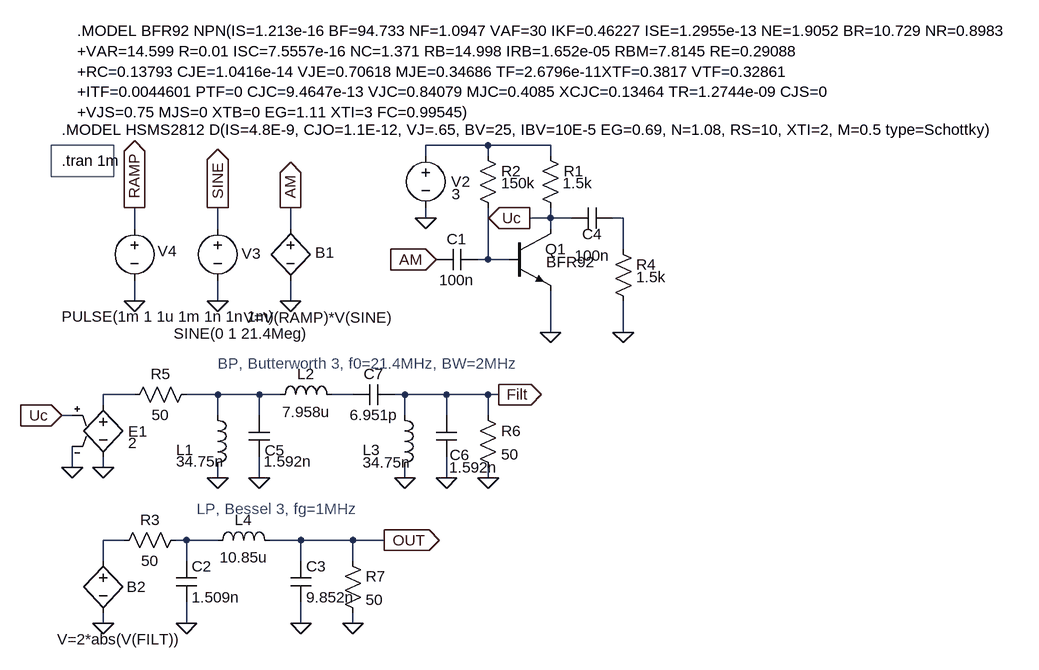
[diagram p0: schematic Rf_Xtoni.asc]
Rf_Xtoni.asc, the LTspice schematic file:
Version 4
SHEET 1 4272 904
WIRE 656 224 656 240
WIRE 656 144 656 128
WIRE 656 128 560 128
WIRE 464 128 464 144
WIRE 656 352 656 416
WIRE 544 304 560 304
WIRE 560 224 560 304
WIRE 560 304 592 304
WIRE 560 144 560 128
WIRE 464 224 464 240
WIRE 656 240 624 240
WIRE 656 240 656 256
WIRE 768 288 768 240
WIRE 768 240 752 240
WIRE 768 368 768 416
WIRE -32 528 -32 512
WIRE -32 512 16 512
WIRE -80 592 -80 624
WIRE -80 544 -96 544
WIRE -32 608 -32 624
WIRE 144 512 96 512
WIRE 144 512 144 544
WIRE 144 512 208 512
WIRE 208 512 208 544
WIRE 208 512 240 512
WIRE 208 608 208 640
WIRE 144 624 144 640
WIRE 320 512 352 512
WIRE 432 512 432 544
WIRE 432 624 432 640
WIRE 432 512 496 512
WIRE 496 512 496 544
WIRE 496 608 496 640
WIRE 496 512 560 512
WIRE 560 512 560 544
WIRE 560 624 560 640
WIRE 416 512 432 512
WIRE 560 512 576 512
WIRE 16 256 16 224
WIRE 144 256 144 224
WIRE 256 256 256 224
WIRE 16 336 16 368
WIRE 144 336 144 368
WIRE 256 336 256 368
WIRE -32 768 -32 736
WIRE -32 736 0 736
WIRE 80 736 96 736
WIRE 96 768 96 736
WIRE 96 736 144 736
WIRE 96 832 96 864
WIRE -32 848 -32 864
WIRE 224 736 272 736
WIRE 272 736 272 768
WIRE 272 832 272 864
WIRE 272 736 352 736
WIRE 352 736 352 768
WIRE 352 848 352 864
WIRE 352 736 400 736
WIRE 560 128 464 128
WIRE 656 240 688 240
FLAG 464 240 0
FLAG 656 416 0
FLAG 624 240 Uc
IOPIN 624 240 Out
FLAG 768 416 0
FLAG 480 304 AM
IOPIN 480 304 In
FLAG -32 624 0
FLAG -80 624 0
FLAG -96 544 Uc
IOPIN -96 544 In
FLAG 144 640 0
FLAG 208 640 0
FLAG 432 640 0
FLAG 496 640 0
FLAG 560 640 0
FLAG 576 512 Filt
IOPIN 576 512 Out
FLAG 16 368 0
FLAG 144 368 0
FLAG 256 368 0
FLAG 16 224 RAMP
IOPIN 16 224 Out
FLAG 256 224 AM
IOPIN 256 224 Out
FLAG 144 224 SINE
IOPIN 144 224 Out
FLAG -32 864 0
FLAG 96 864 0
FLAG 400 736 OUT
IOPIN 400 736 Out
FLAG 272 864 0
FLAG 352 864 0
SYMBOL npn 592 256 R0
WINDOW 3 57 52 Left 0
SYMATTR Value BFR92
SYMATTR InstName Q1
SYMBOL voltage 464 128 R0
WINDOW 0 39 56 Left 0
WINDOW 3 40 75 Left 0
WINDOW 123 0 0 Left 0
WINDOW 39 0 0 Left 0
SYMATTR InstName V2
SYMATTR Value 3
SYMBOL cap 480 320 R270
WINDOW 0 32 32 VTop 0
WINDOW 3 0 32 VBottom 0
SYMATTR InstName C1
SYMATTR Value 100n
SYMBOL res 544 128 R0
WINDOW 3 36 58 Left 0
SYMATTR Value 150k
SYMATTR InstName R2
SYMBOL res 640 128 R0
WINDOW 3 35 58 Left 0
SYMATTR Value 1.5k
SYMATTR InstName R1
SYMBOL cap 752 224 R90
WINDOW 0 56 32 VBottom 0
WINDOW 3 58 32 VTop 0
SYMATTR InstName C4
SYMATTR Value 100n
SYMBOL res 752 272 R0
WINDOW 3 36 59 Left 0
SYMATTR Value 1.5k
SYMATTR InstName R4
SYMBOL e -32 512 R0
WINDOW 0 38 57 Left 0
WINDOW 3 38 74 Left 0
SYMATTR InstName E1
SYMATTR Value 2
SYMBOL res 0 528 R270
WINDOW 0 32 56 VTop 0
WINDOW 3 0 56 VBottom 0
SYMATTR InstName R5
SYMATTR Value 50
SYMBOL ind 128 528 R0
WINDOW 0 -48 69 Left 0
WINDOW 3 -48 87 Left 0
SYMATTR InstName L1
SYMATTR Value 34.75n
SYMBOL cap 192 544 R0
WINDOW 0 24 54 Left 0
WINDOW 3 23 71 Left 0
SYMATTR InstName C5
SYMATTR Value 1.592n
SYMBOL ind 224 528 R270
WINDOW 0 32 56 VTop 0
WINDOW 3 5 56 VBottom 0
SYMATTR InstName L2
SYMATTR Value 7.958u
SYMBOL res 544 528 R0
SYMATTR InstName R6
SYMATTR Value 50
SYMBOL cap 352 528 R270
WINDOW 0 32 32 VTop 0
WINDOW 3 0 32 VBottom 0
SYMATTR InstName C7
SYMATTR Value 6.951p
SYMBOL ind 416 528 R0
WINDOW 0 -49 69 Left 0
WINDOW 3 -49 88 Left 0
SYMATTR InstName L3
SYMATTR Value 34.75n
SYMBOL cap 480 544 R0
WINDOW 0 21 61 Left 0
WINDOW 3 20 80 Left 0
SYMATTR InstName C6
SYMATTR Value 1.592n
SYMBOL voltage 144 240 R0
WINDOW 0 37 55 Left 0
WINDOW 3 -68 178 Left 0
WINDOW 39 0 0 Left 0
SYMATTR InstName V3
SYMATTR Value SINE(0 1 21.4Meg)
SYMATTR Value2 AC 0
SYMBOL voltage 16 240 R0
WINDOW 0 36 51 Left 0
WINDOW 3 -112 152 Left 0
WINDOW 123 0 0 Left 0
WINDOW 39 0 0 Left 0
SYMATTR InstName V4
SYMATTR Value PULSE(1m 1 1u 1m 1n 1n 1m)
SYMBOL bv 256 240 R0
WINDOW 0 38 53 Left 0
WINDOW 3 -72 153 Left 0
SYMATTR InstName B1
SYMATTR Value V=V(RAMP)*V(SINE)
SYMBOL bv -32 752 R0
WINDOW 0 36 56 Left 0
WINDOW 3 -71 137 Left 0
SYMATTR InstName B2
SYMATTR Value V=2*abs(V(FILT))
SYMBOL res -16 752 R270
WINDOW 0 32 56 VTop 0
WINDOW 3 0 56 VBottom 0
SYMATTR InstName R3
SYMATTR Value 50
SYMBOL cap 80 768 R0
SYMATTR InstName C2
SYMATTR Value 1.509n
SYMBOL ind 128 752 R270
WINDOW 0 32 56 VTop 0
WINDOW 3 5 56 VBottom 0
SYMATTR InstName L4
SYMATTR Value 10.85u
SYMBOL cap 256 768 R0
SYMATTR InstName C3
SYMATTR Value 9.852n
SYMBOL res 336 752 R0
SYMATTR InstName R7
SYMATTR Value 50
TEXT -96 152 Left 0 !.tran 1m
TEXT -72 -48 Left 0 !.MODEL BFR92 NPN(IS=1.213e-16 BF=94.733 NF=1.0947 VAF=30 IKF=0.46227 ISE=1.2955e-13 NE=1.9052 BR=10.729 NR=0.8983\n+VAR=14.599 R=0.01 ISC=7.5557e-16 NC=1.371 RB=14.998 IRB=1.652e-05 RBM=7.8145 RE=0.29088\n+RC=0.13793 CJE=1.0416e-14 VJE=0.70618 MJE=0.34686 TF=2.6796e-11XTF=0.3817 VTF=0.32861\n+ITF=0.0044601 PTF=0 CJC=9.4647e-13 VJC=0.84079 MJC=0.4085 XCJC=0.13464 TR=1.2744e-09 CJS=0\n+VJS=0.75 MJS=0 XTB=0 EG=1.11 XTI=3 FC=0.99545)
TEXT -96 104 Left 0 !.MODEL HSMS2812 D(IS=4.8E-9, CJO=1.1E-12, VJ=.65, BV=25, IBV=10E-5 EG=0.69, N=1.08, RS=10, XTI=2, M=0.5 type=Schottky)
TEXT 144 464 Left 0 ;BP, Butterworth 3, f0=21.4MHz, BW=2MHz
TEXT 112 688 Left 0 ;LP, Bessel 3, fg=1MHz
RECTANGLE Normal -16 176 -112 128

The netlist it stands for:
* Rf_Xtoni.asc
Q1 Uc N002 0 0 BFR92
V2 N001 0 3
C1 AM N002 100n
R2 N001 N002 150k
R1 N001 Uc 1.5k
C4 N003 Uc 100n
R4 N003 0 1.5k
E1 N004 0 Uc 0 2
R5 N004 N005 50
L1 N005 0 34.75n
C5 N005 0 1.592n
L2 N005 N006 7.958u
R6 Filt 0 50
C7 N006 Filt 6.951p
L3 Filt 0 34.75n
C6 Filt 0 1.592n
V3 SINE 0 SINE(0 1 21.4Meg) AC 0
V4 RAMP 0 PULSE(1m 1 1u 1m 1n 1n 1m)
B1 AM 0 V=V(RAMP)*V(SINE)
B2 N007 0 V=2*abs(V(FILT))
R3 N007 N008 50
C2 N008 0 1.509n
L4 N008 OUT 10.85u
C3 OUT 0 9.852n
R7 OUT 0 50
.model NPN NPN
.model PNP PNP
.lib standard.bjt
.tran 1m
.MODEL BFR92 NPN(IS=1.213e-16 BF=94.733 NF=1.0947 VAF=30 IKF=0.46227 ISE=1.2955e-13 NE=1.9052 BR=10.729 NR=0.8983
+VAR=14.599 R=0.01 ISC=7.5557e-16 NC=1.371 RB=14.998 IRB=1.652e-05 RBM=7.8145 RE=0.29088
+RC=0.13793 CJE=1.0416e-14 VJE=0.70618 MJE=0.34686 TF=2.6796e-11XTF=0.3817 VTF=0.32861
+ITF=0.0044601 PTF=0 CJC=9.4647e-13 VJC=0.84079 MJC=0.4085 XCJC=0.13464 TR=1.2744e-09 CJS=0
+VJS=0.75 MJS=0 XTB=0 EG=1.11 XTI=3 FC=0.99545)
.MODEL HSMS2812 D(IS=4.8E-9, CJO=1.1E-12, VJ=.65, BV=25, IBV=10E-5 EG=0.69, N=1.08, RS=10, XTI=2, M=0.5 type=Schottky)
* BP, Butterworth 3, f0=21.4MHz, BW=2MHz
* LP, Bessel 3, fg=1MHz
.backanno
.end